# EAGLE schematic AutoSpiel (EAGLE 9.2.0)
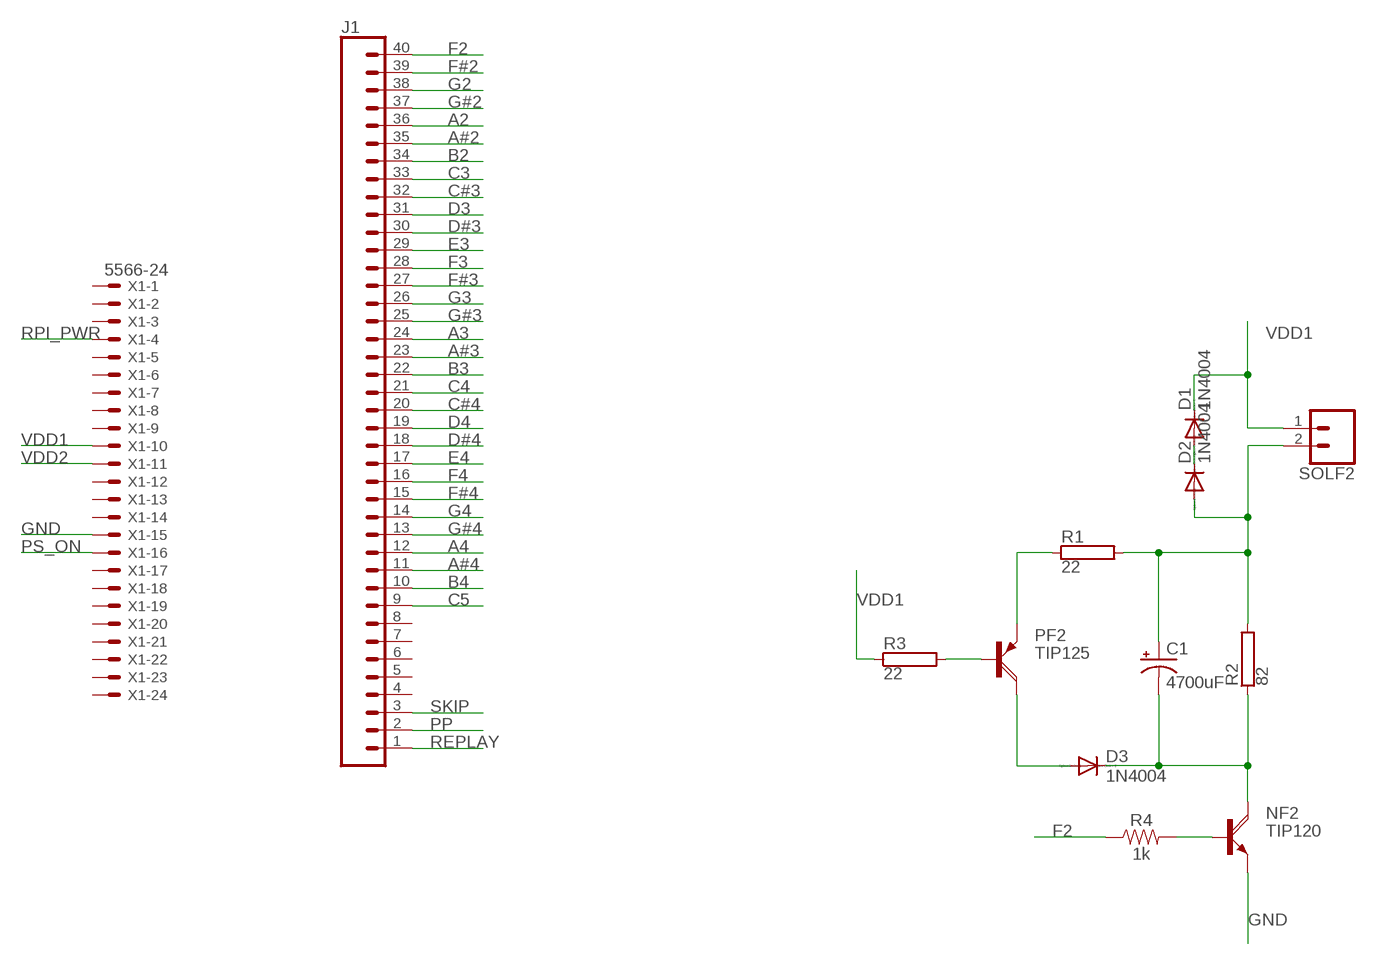
[diagram p0: schematic, sheet 1]

## Parts
C1  4700uF  CPOL-USE5-13  [E5-13]
D1  1N4004  [DO41-10]
D2  1N4004  [DO41-10]
D3  1N4004  [DO41-10]
J1  CONN_40  [1X40]
NF2  TIP120  [TO220AH]
PF2  TIP125  [TO220AH]
R1  22  RAC01  [AC01]
R2  82  RAC01  [AC01]
R3  22  RAC01  [AC01]
R4  1k  1KOHM-HORIZ_KIT-1/4W-5%  [AXIAL-0.3-KIT]
SOLF2  CONN_02PTH4  [1X02_XTRA_BIG]
X1  5566-24  [5566-24]

## Nets
A2: J1.36
A3: J1.24
A4: J1.12
A#2: J1.35
A#3: J1.23
A#4: J1.11
B2: J1.34
B3: J1.22
B4: J1.10
C3: J1.33
C4: J1.21
C5: J1.9
C#3: J1.32
C#4: J1.20
D3: J1.31
D4: J1.19
D#3: J1.30
D#4: J1.18
E3: J1.29
E4: J1.17
F2: J1.40 R4.P$1
F3: J1.28
F4: J1.16
F#2: J1.39
F#3: J1.27
F#4: J1.15
G2: J1.38
G3: J1.26
G4: J1.14
G#2: J1.37
G#3: J1.25
G#4: J1.13
GND: NF2.E X1.15
N$1: NF2.B R4.P$2
N$3: PF2.E R1.1
N$4: D3.A PF2.C
N$5: C1.- D3.C NF2.C R2.1
N$7: D1.A D2.C
PP: J1.2
PS_ON: X1.16
REPLAY: J1.1
RPI_PWR: X1.4
SKIP: J1.3
SOLGND1: C1.+ D2.A R1.2 R2.2 SOLF2.2
SOLGND2: PF2.B R3.2
VDD1: D1.C R3.1 SOLF2.1 X1.10
VDD2: X1.11
Unconnected: J1.4 J1.5 J1.6 J1.7 J1.8 X1.1 X1.2 X1.3 X1.5 X1.6 X1.7 X1.8 X1.9 X1.12 X1.13 X1.14 X1.17 X1.18 X1.19 X1.20 X1.21 X1.22 X1.23 X1.24

## Library data of the parts
C1 = rcl:CPOL-US: POLARIZED CAPACITOR, American symbol; SPICEPREFIX: C
D1-D3 = diode:1N4004: DIODE general purpose rectifier, 1 A
J1 = SparkFun-Connectors:CONN_40: Multi connection point. Often used as Generic Header-pin footprint for 0.1 inch spaced/style header connections On any of the 0.1 inch spaced packages, you can populate with these: Break Away Headers - Straight <https://www.sparkfun.com/products/116> (PRT-00116) Break Away Male Headers - Right Angle <https://www.sparkfun.com/products/553> (PRT-00553) Female Headers <https://www.sparkfun.com/products/115> (PRT-00115) Break Away Headers - Machine Pin <https://www.sparkfun.com/products/117> (PRT-00117) Break Away Female Headers - Swiss Machine Pin <https://www.sparkfun.com/products/743> (PRT-00743) For SCREWTERMINALS and SPRING TERMINALS visit here: Screw Terimnals on SparkFun.com <https://www.sparkfun.com/search/results?term=Screw+Terminals> (5mm/3.5mm/2.54mm spacing) This device is also useful as a general connection point to wire up your design to another part of your project. Our various solder wires solder well into these plated through hole pads. Hook-Up Wire - Assortment (Stranded, 22 AWG) <https://www.sparkfun.com/products/11375> (PRT-11375) Hook-Up Wire - Assortment (Solid Core, 22 AWG) <https://www.sparkfun.com/products/11367> (PRT-11367) View the entire wire category on our website here <https://www.sparkfun.com/categories/141> Special notes: Molex polarized connector foot print use with SKU : PRT-08231 with associated crimp pins and housings. 1MM SMD Version SKU: PRT-10208 NOTES ON THE VARIANTS LOCK and LOCK_LONGPADS... This footprint was designed to help hold the alignment of a through-hole component (i.e. 6-pin header) while soldering it into place. You may notice that each hole has been shifted either up or down by 0.005 of an inch from it's more standard position (which is a perfectly straight line). This slight alteration caused the pins (the squares in the middle) to touch the edges of the holes. Because they are alternating, it causes a "brace" to hold the component in place. 0.005 has proven to be the perfect amount of "off-center" position when using our standard breakaway headers. Although looks a little odd when you look at the bare footprint, once you have a header in there, the alteration is very hard to notice. Also,if you push a header all the way into place, it is covered up entirely on the bottom side.
NF2 = transistor-power:TIP120: NPN DARLINGTON TRANSISTOR
PF2 = transistor-power:TIP125: PNP DARLINGTON TRANSISTOR
R1-R3 = resistor-power:R: Power Resitor; OC_FARNELL: unknown; OC_NEWARK: unknown
R4 = SparkFun-Resistors:1KOHM: 1kΩ resistor A resistor is a passive two-terminal electrical component that implements electrical resistance as a circuit element. Resistors act to reduce current flow, and, at the same time, act to lower voltage levels within circuits. - Wikipedia; PROD_ID: RES-08380
SOLF2 = SparkFun-Connectors:CONN_02: Multi connection point. Often used as Generic Header-pin footprint for 0.1 inch spaced/style header connections On any of the 0.1 inch spaced packages, you can populate with these: Break Away Headers - Straight <https://www.sparkfun.com/products/116> (PRT-00116) Break Away Male Headers - Right Angle <https://www.sparkfun.com/products/553> (PRT-00553) Female Headers <https://www.sparkfun.com/products/115> (PRT-00115) Break Away Headers - Machine Pin <https://www.sparkfun.com/products/117> (PRT-00117) Break Away Female Headers - Swiss Machine Pin <https://www.sparkfun.com/products/743> (PRT-00743) For SCREWTERMINALS and SPRING TERMINALS visit here: Screw Terimnals on SparkFun.com <https://www.sparkfun.com/search/results?term=Screw+Terminals> (5mm/3.5mm/2.54mm spacing) This device is also useful as a general connection point to wire up your design to another part of your project. Our various solder wires solder well into these plated through hole pads. Hook-Up Wire - Assortment (Stranded, 22 AWG) <https://www.sparkfun.com/products/11375> (PRT-11375) Hook-Up Wire - Assortment (Solid Core, 22 AWG) <https://www.sparkfun.com/products/11367> (PRT-11367) View the entire wire category on our website here <https://www.sparkfun.com/categories/141> Special notes: Molex polarized connector foot print use with: PRT-08233 with associated crimp pins and housings. 2.54_SCREWTERM for use with PRT-10571. 3.5mm Screw Terminal footprints for PRT-08084 5mm Screw Terminal footprints for use with PRT-08432
X1 = con-molex:5566-24: Mini FIT connector 24 pol Source: http://www.molex.com; MF: MOLEX; OC_FARNELL: unknown; OC_NEWARK: unknown